# EAGLE schematic Tag PCB V1 (EAGLE 9.2.0)
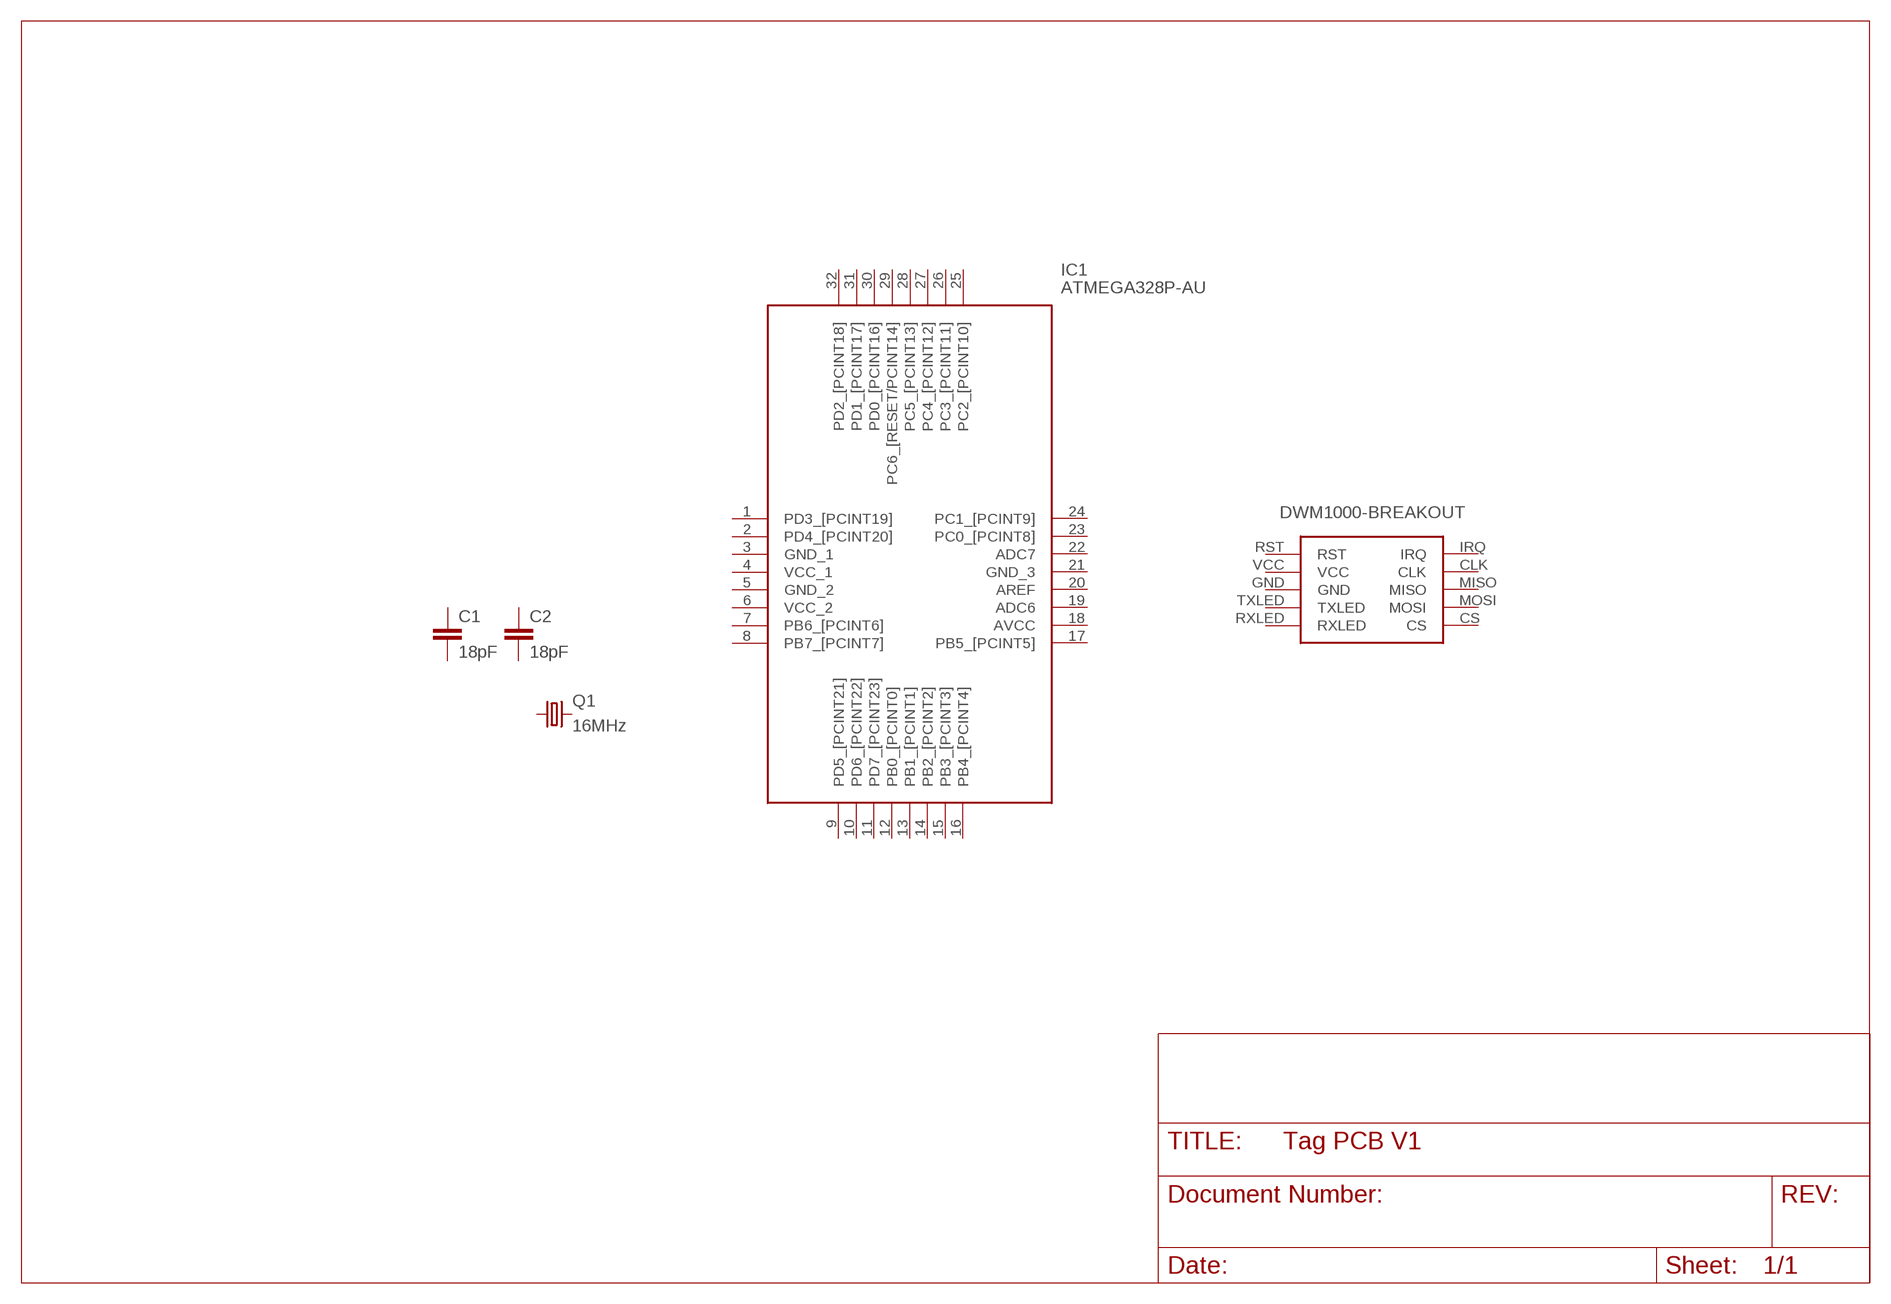
[diagram p0: schematic, sheet 1]

## Parts
C1  18pF  C-EUC0805  [C0805]
C2  18pF  C-EUC0805  [C0805]
IC1  ATMEGA328P-AU  [QFP80P900X900X120-32N]
Q1  16MHz  CRYSTALHC49UP  [HC49UP]
U$1  DWM1000-BREAKOUT  [DWM1000-BREAKOUT]
Unconnected: C1.1 C1.2 C2.1 C2.2 IC1.1(PD3_[PCINT19]) IC1.2(PD4_[PCINT20]) IC1.7(PB6_[PCINT6]) IC1.8(PB7_[PCINT7]) IC1.9(PD5_[PCINT21]) IC1.10(PD6_[PCINT22]) IC1.11(PD7_[PCINT23]) IC1.12(PB0_[PCINT0]) IC1.13(PB1_[PCINT1]) IC1.14(PB2_[PCINT2]) IC1.15(PB3_[PCINT3]) IC1.16(PB4_[PCINT4]) IC1.17(PB5_[PCINT5]) IC1.19(ADC6) IC1.20(AREF) IC1.22(ADC7) IC1.23(PC0_[PCINT8]) IC1.24(PC1_[PCINT9]) IC1.25(PC2_[PCINT10]) IC1.26(PC3_[PCINT11]) IC1.27(PC4_[PCINT12]) IC1.28(PC5_[PCINT13]) IC1.29(PC6_[RESET/PCINT14]) IC1.30(PD0_[PCINT16]) IC1.31(PD1_[PCINT17]) IC1.32(PD2_[PCINT18]) Q1.1 Q1.2 U$1.CLK U$1.CS U$1.GND U$1.IRQ U$1.MISO U$1.MOSI U$1.RST U$1.RXLED U$1.TXLED U$1.VCC

## Power pins joined to a net without a drawn wire
AVCC: IC1.18(AVCC)
GND_1: IC1.3(GND_1)
GND_2: IC1.5(GND_2)
GND_3: IC1.21(GND_3)
VCC_1: IC1.4(VCC_1)
VCC_2: IC1.6(VCC_2)

## Library data of the parts
C1 C2 = rcl:C-EU: CAPACITOR, European symbol; SPICEPREFIX: C
IC1 = ATMEGA328P-AU:ATMEGA328P-AU: MICROCHIP - ATMEGA328P-AU. - MICROCONTROLLER MCU, 8 BIT, ATMEGA, 20MHZ, TQFP-32 Source: Datasheet <https://componentsearchengine.com/Datasheets/2/ATMEGA328P-AU.pdf>; ARROW_PART_NUMBER: ATMEGA328P-AU; ARROW_PRICE-STOCK: https://www.arrow.com/en/products/atmega328p-au/microchip-technology; DESCRIPTION: MICROCHIP - ATMEGA328P-AU. - MICROCONTROLLER MCU, 8 BIT, ATMEGA, 20MHZ, TQFP-32; HEIGHT: 1.2mm; MANUFACTURER_NAME: Microchip; MANUFACTURER_PART_NUMBER: ATMEGA328P-AU; RS_PART_NUMBER: 1310271; RS_PRICE-STOCK: http://uk.rs-online.com/web/p/products/1310271
Q1 = crystal:CRYSTAL: CRYSTAL; OC_FARNELL: unknown; OC_NEWARK: unknown
U$1 = Eigen Library:DWM1000-BREAKOUT